# EAGLE design debug (EAGLE 9.6.2)

## Sheet 1 of 2: COVER
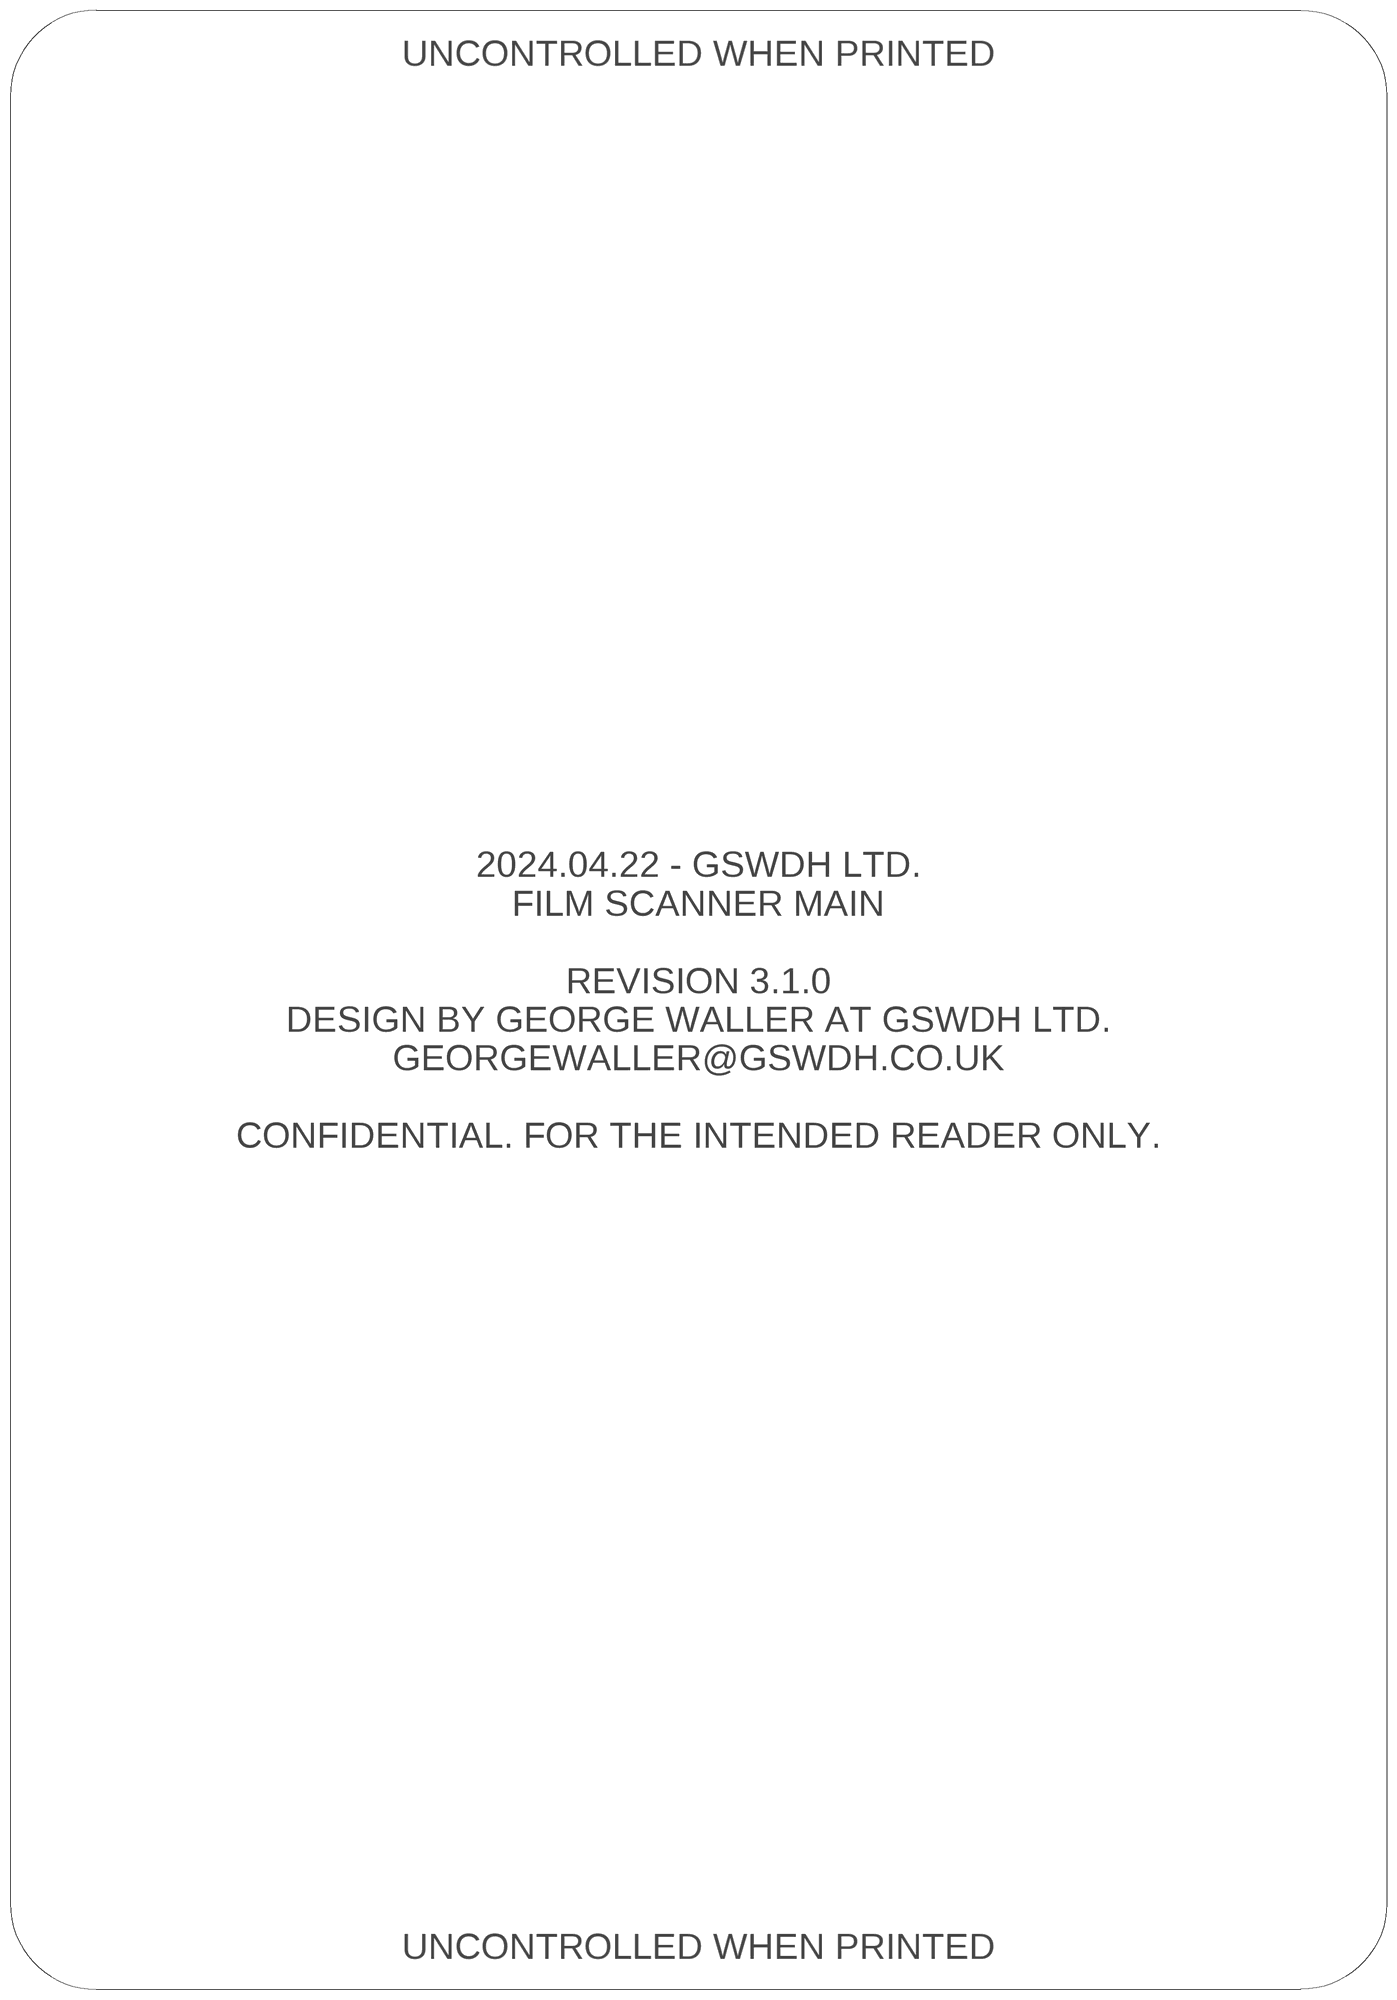
[diagram p0: schematic, sheet 1]

### Notes on the sheet
- UNCONTROLLED WHEN PRINTED
- 2024.04.22 - GSWDH LTD.
  FILM SCANNER MAIN
  
  REVISION 3.1.0
  DESIGN BY GEORGE WALLER AT GSWDH LTD.
  GEORGEWALLER@GSWDH.CO.UK
  
  CONFIDENTIAL. FOR THE INTENDED READER ONLY.
- UNCONTROLLED WHEN PRINTED

## Sheet 2 of 2: PROC
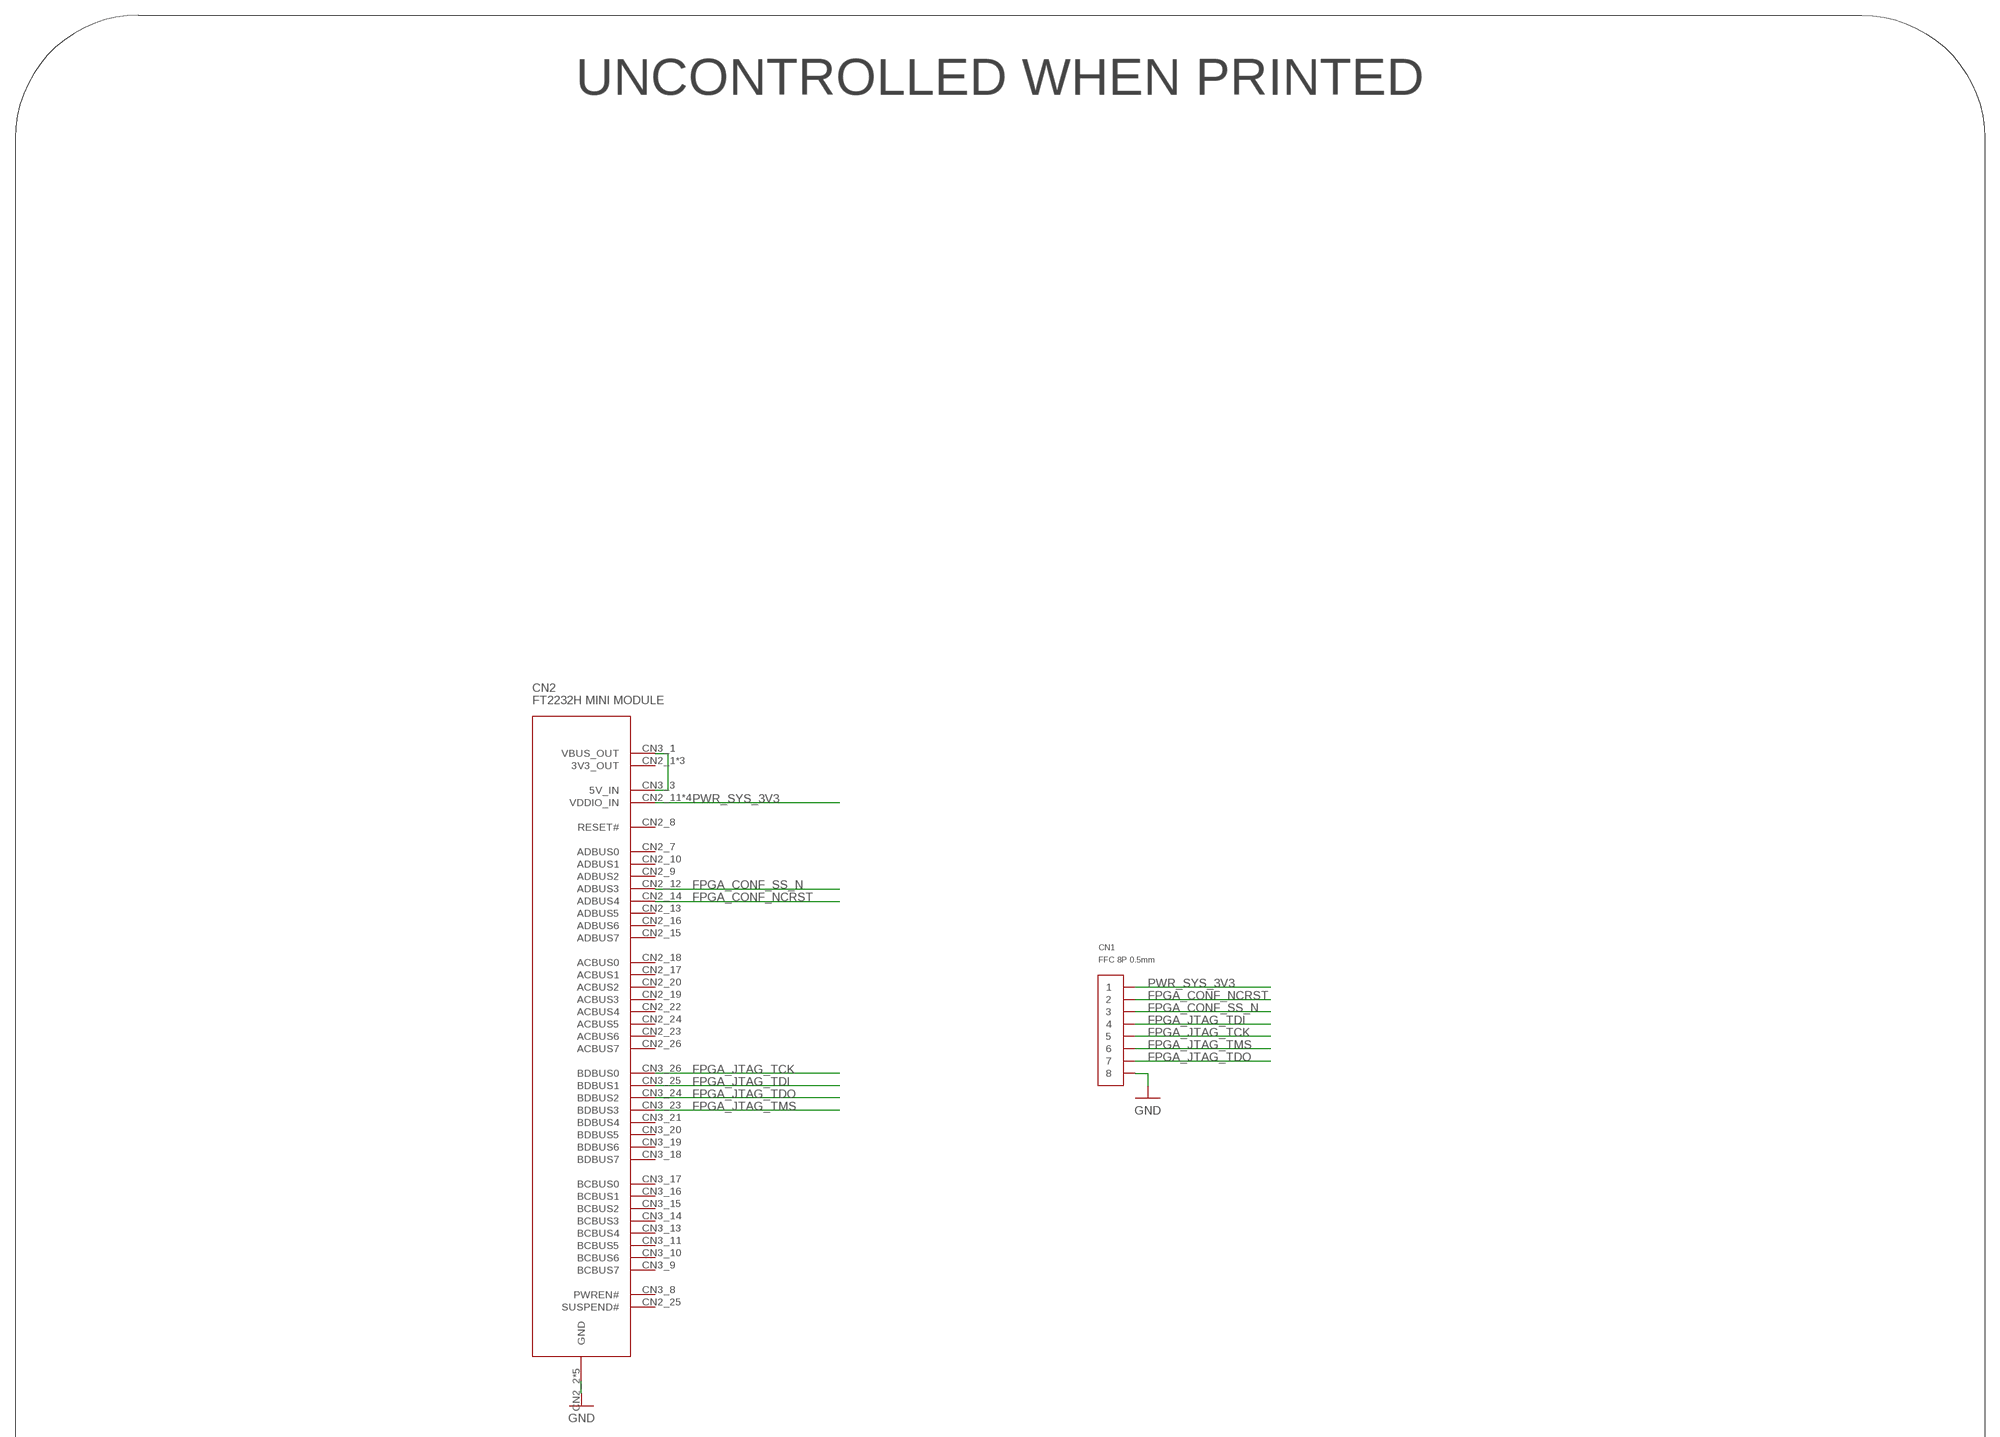
[diagram p1: schematic, sheet 2, part 1 of 2]
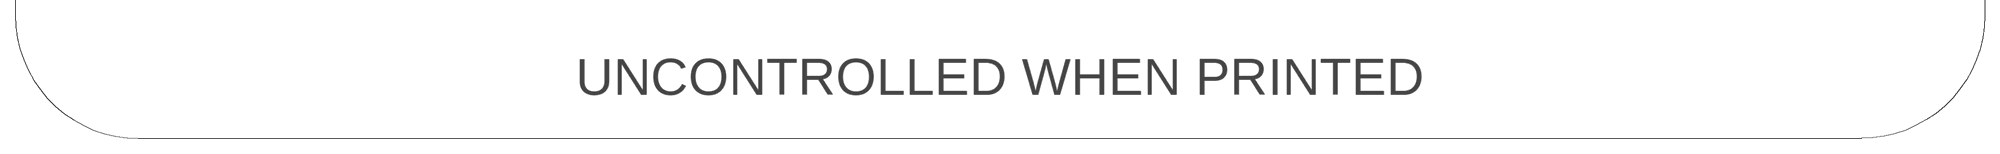
[diagram p2: schematic, sheet 2, part 2 of 2]

### Parts
CN1  FFC 8P 0.5mm  HC-FPC-05-09-8RLTAG  [HC-FPC-05-09-8RLTAG]
CN2  FT2232H MINI MODULE  FT2232H_MINI_MODULE  [FT2232H_MINI_MODULE]

### Nets
FPGA_CONF_NCRST: CN1.2 CN2.CN2_14(ADBUS4)
FPGA_CONF_SS_N: CN1.3 CN2.CN2_12(ADBUS3)
FPGA_JTAG_TCK: CN1.5 CN2.CN3_26(BDBUS0)
FPGA_JTAG_TDI: CN1.4 CN2.CN3_25(BDBUS1)
FPGA_JTAG_TDO: CN1.7 CN2.CN3_24(BDBUS2)
FPGA_JTAG_TMS: CN1.6 CN2.CN3_23(BDBUS3)
GND: CN1.8 CN2.CN2_2(GND) CN2.CN2_4(GND) CN2.CN2_6(GND) CN2.CN3_2(GND) CN2.CN3_4(GND)
N$1: CN2.CN3_1(VBUS_OUT) CN2.CN3_3(5V_IN)
PWR_SYS_3V3: CN1.1 CN2.CN2_11(VDDIO_IN) CN2.CN2_21(VDDIO_IN) CN2.CN3_12(VDDIO_IN) CN2.CN3_22(VDDIO_IN)
Unconnected: CN2.CN2_1(3V3_OUT) CN2.CN2_3(3V3_OUT) CN2.CN2_5(3V3_OUT) CN2.CN2_7(ADBUS0) CN2.CN2_8(RESET#) CN2.CN2_9(ADBUS2) CN2.CN2_10(ADBUS1) CN2.CN2_13(ADBUS5) CN2.CN2_15(ADBUS7) CN2.CN2_16(ADBUS6) CN2.CN2_17(ACBUS1) CN2.CN2_18(ACBUS0) CN2.CN2_19(ACBUS3) CN2.CN2_20(ACBUS2) CN2.CN2_22(ACBUS4) CN2.CN2_23(ACBUS6) CN2.CN2_24(ACBUS5) CN2.CN2_25(SUSPEND#) CN2.CN2_26(ACBUS7) CN2.CN3_8(PWREN#) CN2.CN3_9(BCBUS7) CN2.CN3_10(BCBUS6) CN2.CN3_11(BCBUS5) CN2.CN3_13(BCBUS4) CN2.CN3_14(BCBUS3) CN2.CN3_15(BCBUS2) CN2.CN3_16(BCBUS1) CN2.CN3_17(BCBUS0) CN2.CN3_18(BDBUS7) CN2.CN3_19(BDBUS6) CN2.CN3_20(BDBUS5) CN2.CN3_21(BDBUS4)

### Notes on the sheet
- UNCONTROLLED WHEN PRINTED
- UNCONTROLLED WHEN PRINTED

## Library data of the parts
CN1 = CONNECTORs:HC-FPC-05-09-8RLTAG: Clamshell 8P Double-sided contacts/up and down connection Surface Mount，Right Angle 0.5mm SMD,P=0.5mm,Surface Mount，Right Angle FFC/FPC Connectors ROHS; HEIGHT: 2; LCSC: C5213749; PRICE_PER: 0.0644
CN2 = MODULES:FT2232H_MINI_MODULE: FT2232H USB 2.0 to I2C, JTAG, SPI, UART Interface Evaluation Board. Ideally needs a pair of connectors such as PPTC132LFBN-RC.; DIGIKEY: 768-1030-ND; HEIGHT: 12; PRICE_PER: 24.84

## Board
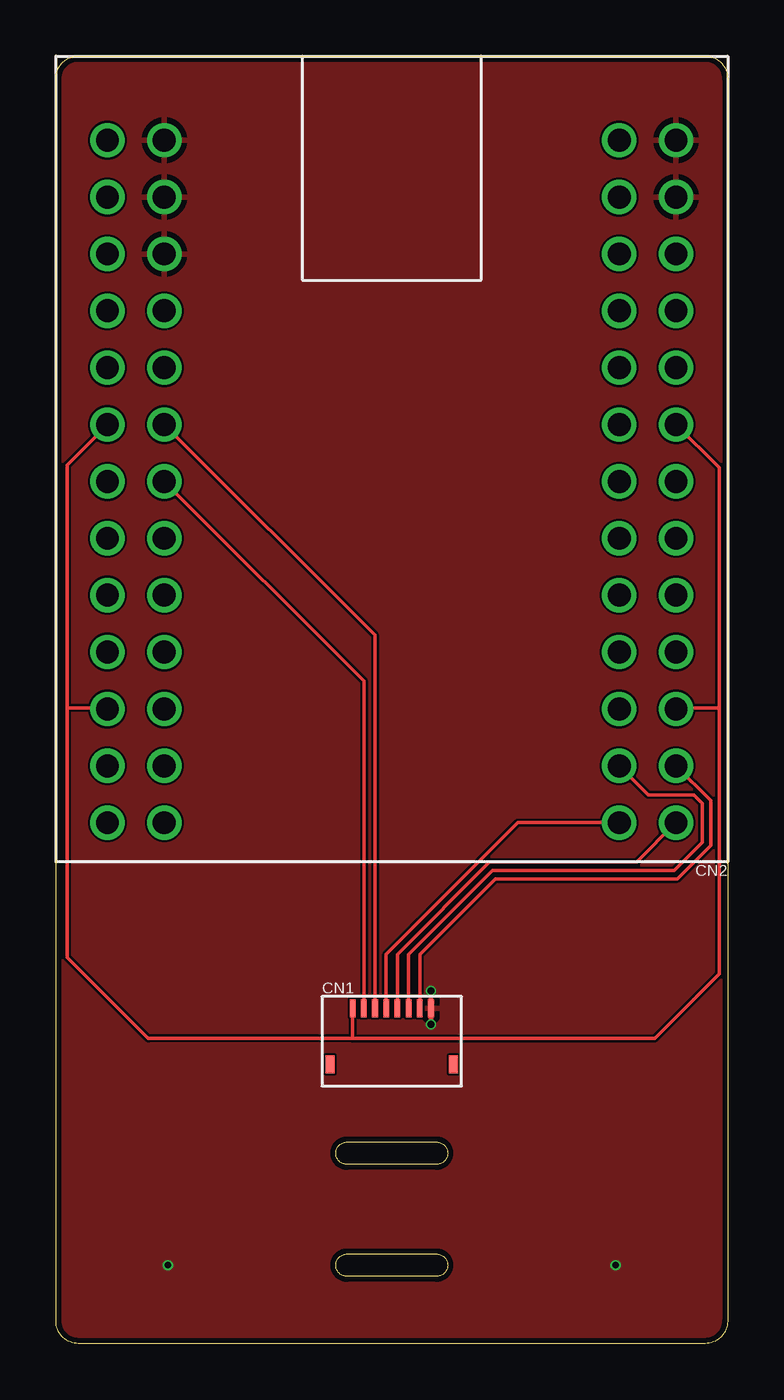
[diagram p3: board, top side]
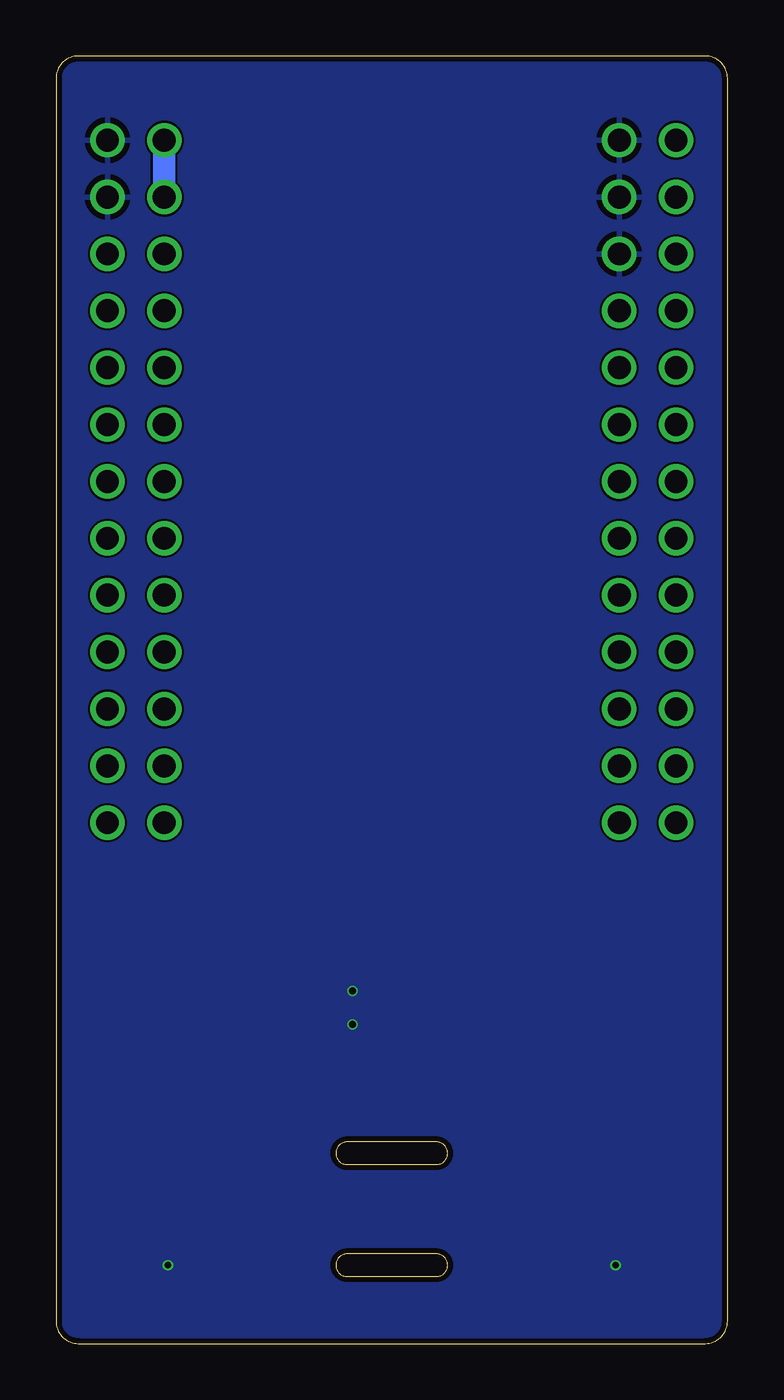
[diagram p4: board, bottom side, seen from below]

Size 30 x 57.5 mm. Coordinates in mm from the lower left corner, seen from the top.
Outline: 29,0 1,0 arc-90 0,1 0,56.5 arc-90 1,57.5 29,57.5 arc-90 30,56.5 30,1 arc-90 29,0
Outline: 13,9 17,9 arc-90 17.5,8.5 arc-90 17,8 13,8 arc-90 12.5,8.5 arc-90 13,9
Outline: 13,4 17,4 arc-90 17.5,3.5 arc-90 17,3 13,3 arc-90 12.5,3.5 arc-90 13,4
Copper layers (1*2*3*16): Top 0.035mm / dielectric 1.5mm / GND 0.035mm / dielectric 0.15mm / PWR 0.035mm / dielectric 0.2mm / Bottom 0.035mm
Design rules "myDRC 4 layers 4mil_4mil 0.2mm via": minimum track width 4mil, minimum drill 0.2mm, track to track 4mil, track to pad 4mil, pad to pad 4mil, via to via 4mil, smd to smd 0mil, copper to edge 0.25mm, drill to drill 0.25mm, minimum pad ring 10mil, minimum via ring 3mil, stop-mask expansion 4mil, vias tented up to drill 0.3mm, thermal gap 10mil

### Footprints (pad centres in the part's own frame; a part is rotated, then mirrored left to right if it is on the bottom)
HC-FPC-05-09-8RLTAG = smd 0.25 x 0.8: 1 -1.75,1.475; 2 -1.25,1.475; 3 -0.75,1.475; 4 -0.25,1.475; 5 0.25,1.475; 6 0.75,1.475; 7 1.25,1.475; 8 1.75,1.475 | smd 0.4 x 0.8: P$1 -2.75,-1.025; P$2 2.75,-1.025
FT2232H_MINI_MODULE = drill 1.02: CN2_1 -12.7,15.24; CN2_2 -10.16,15.24; CN2_3 -12.7,12.7; CN2_4 -10.16,12.7; CN2_5 -12.7,10.16; CN2_6 -10.16,10.16; CN2_7 -12.7,7.62; CN2_8 -10.16,7.62; CN2_9 -12.7,5.08; CN2_10 -10.16,5.08; CN2_11 -12.7,2.54; CN2_12 -10.16,2.54; CN2_13 -12.7,0; CN2_14 -10.16,0; CN2_15 -12.7,-2.54; CN2_16 -10.16,-2.54; CN2_17 -12.7,-5.08; CN2_18 -10.16,-5.08; CN2_19 -12.7,-7.62; CN2_20 -10.16,-7.62; CN2_21 -12.7,-10.16; CN2_22 -10.16,-10.16; CN2_23 -12.7,-12.7; CN2_24 -10.16,-12.7; CN2_25 -12.7,-15.24; CN2_26 -10.16,-15.24; CN3_1 10.16,15.24; CN3_2 12.7,15.24; CN3_3 10.16,12.7; CN3_4 12.7,12.7; CN3_5 10.16,10.16; CN3_6 12.7,10.16; CN3_7 10.16,7.62; CN3_8 12.7,7.62; CN3_9 10.16,5.08; CN3_10 12.7,5.08; CN3_11 10.16,2.54; CN3_12 12.7,2.54; CN3_13 10.16,0; CN3_14 12.7,0; CN3_15 10.16,-2.54; CN3_16 12.7,-2.54; CN3_17 10.16,-5.08; CN3_18 12.7,-5.08; CN3_19 10.16,-7.62; CN3_20 12.7,-7.62; CN3_21 10.16,-10.16; CN3_22 12.7,-10.16; CN3_23 10.16,-12.7; CN3_24 12.7,-12.7; CN3_25 10.16,-15.24; CN3_26 12.7,-15.24

### Placement (x,y rotation side)
CN1  15,13.5 0 top
CN2  15,38.5 0 top

### Tracks (layer width: path | path; a pad name or v marks a point on that pad's centre or on a via)
FPGA_CONF_NCRST
  Top 0.15: CN2.CN2_14 13.75,29.59 CN1.2
FPGA_CONF_SS_N
  Top 0.15: CN2.CN2_12 14.25,31.63 CN1.3
FPGA_JTAG_TCK
  Top 0.15: CN1.5 15.25,17.38 19.38,21.5 25.94,21.5 CN2.CN3_26
FPGA_JTAG_TDI
  Top 0.15: CN1.4 14.75,17.38 20.63,23.26 CN2.CN3_25
FPGA_JTAG_TDO
  Top 0.15: CN1.7 16.25,17.38 19.62,20.75 27.75,20.75 29.25,22.25 29.25,24.25 CN2.CN3_24
FPGA_JTAG_TMS
  Top 0.15: CN1.6 15.75,17.38 19.5,21.12 27.62,21.12 28.88,22.38 28.88,24.12 28.5,24.5 26.46,24.5 CN2.CN3_23
GND  (via drill 0.3)
  Top 0.15: v16.75,14.25 CN1.8 v16.75,15.75
  other vias: 5,3.5 25,3.5
  pour Bottom: -3.62,-2.5 34.5,-2.5 34.5,62 -3.62,62
  pour Top: -5.62,-2.5 32.5,-2.5 32.5,62 -5.62,62
N$1
  Bottom 1: CN2.CN3_3 CN2.CN3_1
PWR_SYS_3V3
  Top 0.15: CN1.1 13.25,13.62 | 0.5,28.38 0.5,17.25 4.12,13.62 13.25,13.62 | 0.5,28.38 0.5,39.24 CN2.CN2_11 | CN2.CN2_21 2.27,28.38 0.5,28.38 | 13.25,13.62 26.75,13.62 29.62,16.5 29.62,28.38 | CN2.CN3_12 29.62,39.12 29.62,28.38 | 29.62,28.38 27.73,28.38 CN2.CN3_22